# Altium schematic sheet AUX_CurrentSource.SchDoc
size B; SheetNumber: 5; SheetTotal: 15
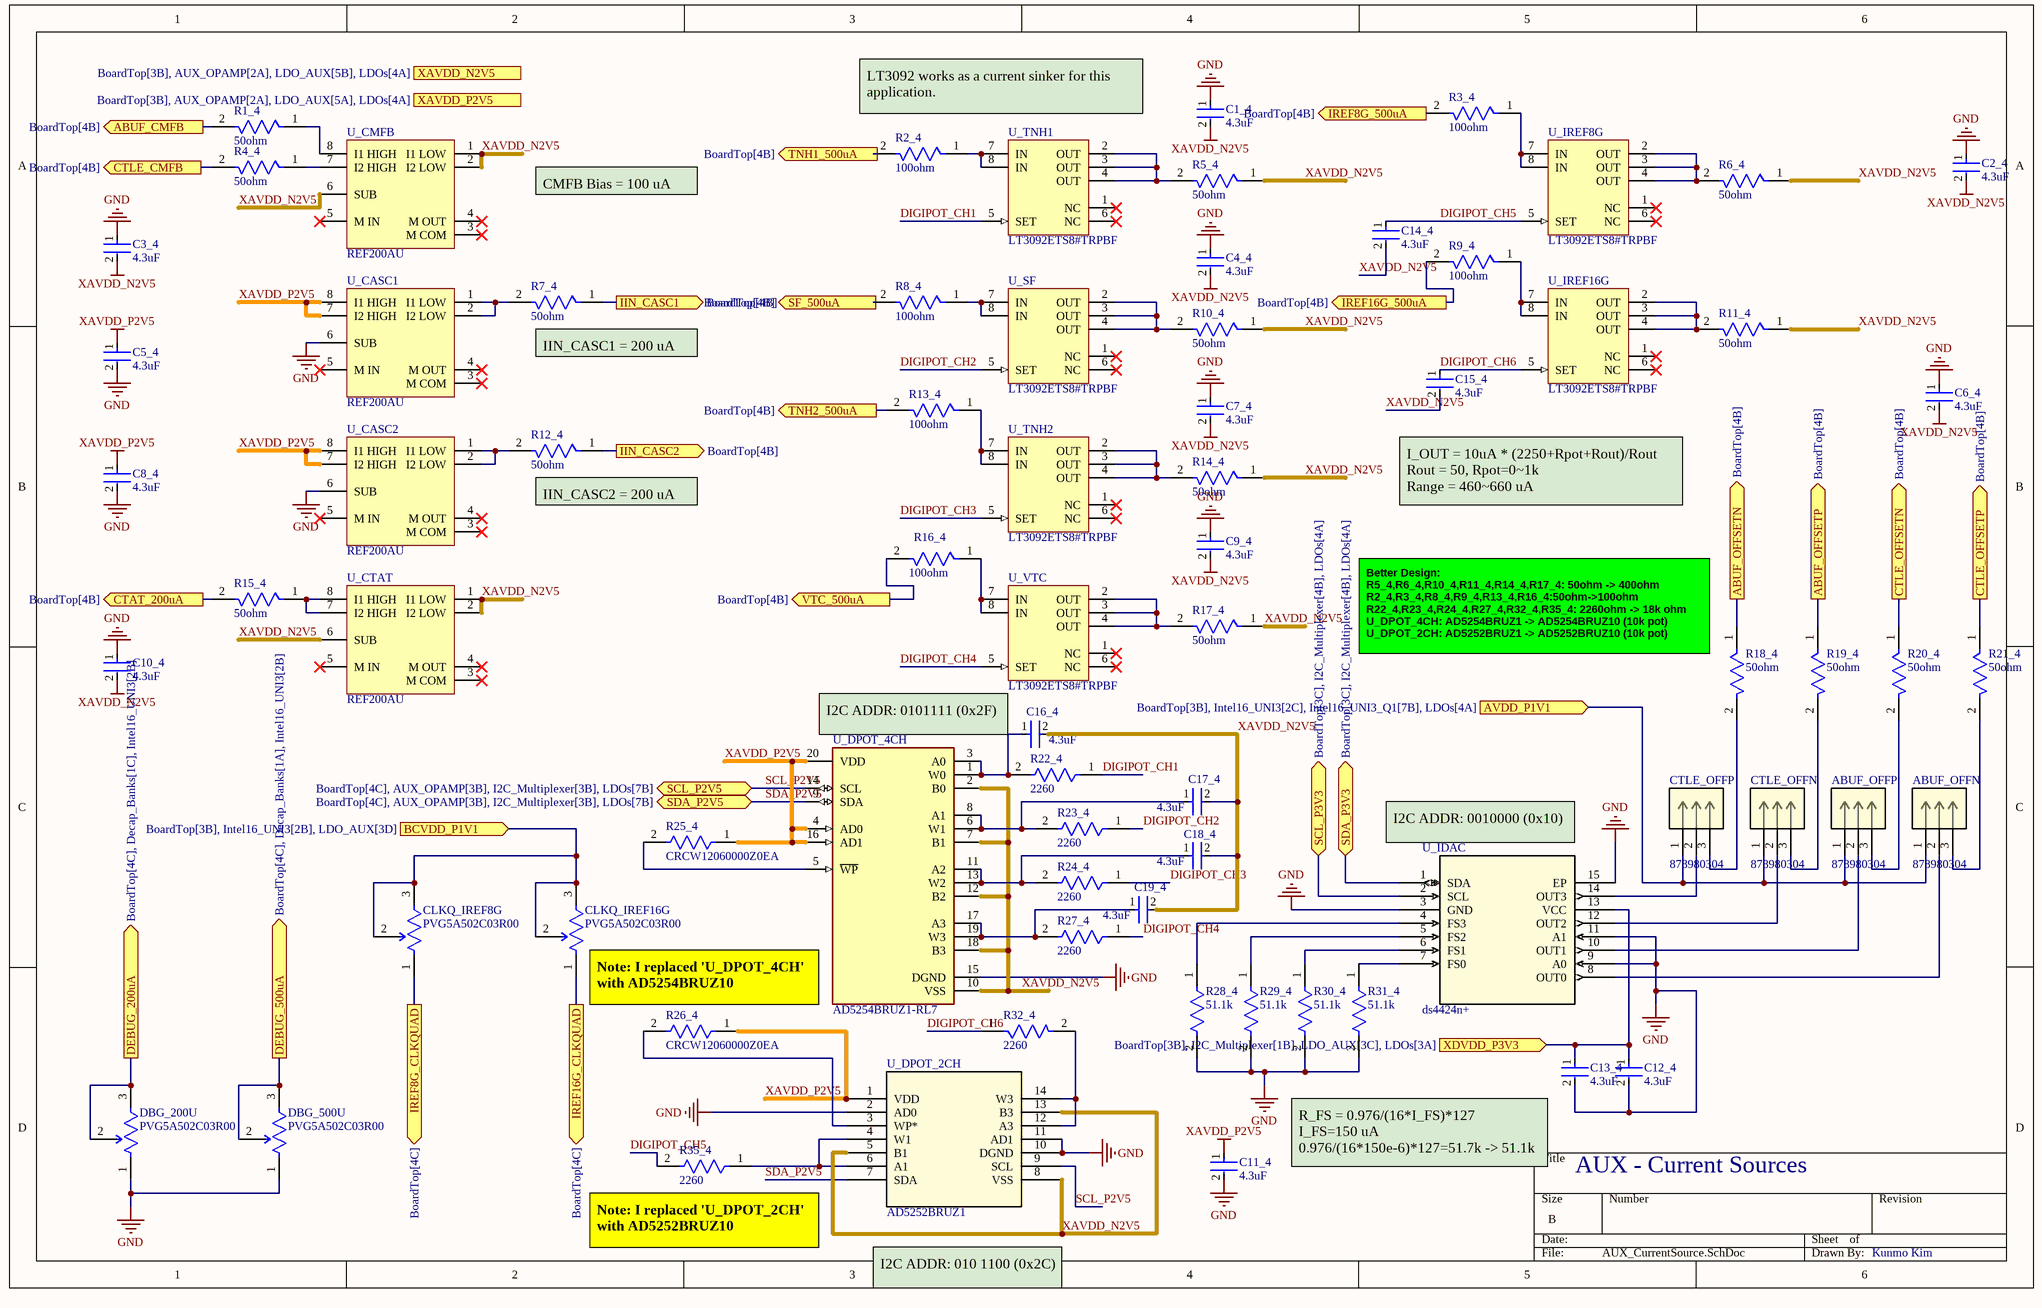
[diagram p0: AUX_CurrentSource.SchDoc]

## Parts
ABUF_OFFN  878980304  [CONN03_87898_M-5p84_MOL]
ABUF_OFFP  878980304  [CONN03_87898_M-5p84_MOL]
C1_4  4.3uF  [FP-LLL1U4-0_05-MFG]
C2_4  4.3uF  [FP-LLL1U4-0_05-MFG]
C3_4  4.3uF  [FP-LLL1U4-0_05-MFG]
C4_4  4.3uF  [FP-LLL1U4-0_05-MFG]
C5_4  4.3uF  [FP-LLL1U4-0_05-MFG]
C6_4  4.3uF  [FP-LLL1U4-0_05-MFG]
C7_4  4.3uF  [FP-LLL1U4-0_05-MFG]
C8_4  4.3uF  [FP-LLL1U4-0_05-MFG]
C9_4  4.3uF  [FP-LLL1U4-0_05-MFG]
C10_4  4.3uF  [FP-LLL1U4-0_05-MFG]
C11_4  4.3uF  [FP-LLL1U4-0_05-MFG]
C12_4  4.3uF  [FP-LLL1U4-0_05-MFG]
C13_4  4.3uF  [FP-LLL1U4-0_05-MFG]
C14_4  4.3uF  [FP-LLL1U4-0_05-MFG]
C15_4  4.3uF  [FP-LLL1U4-0_05-MFG]
C16_4  4.3uF  [FP-LLL1U4-0_05-MFG]
C17_4  4.3uF  [FP-LLL1U4-0_05-MFG]
C18_4  4.3uF  [FP-LLL1U4-0_05-MFG]
C19_4  4.3uF  [FP-LLL1U4-0_05-MFG]
CLKQ_IREF8G  PVG5A502C03R00  [FP-PVG5A-MFG]
CLKQ_IREF16G  PVG5A502C03R00  [FP-PVG5A-MFG]
CTLE_OFFN  878980304  [CONN03_87898_M-5p84_MOL]
CTLE_OFFP  878980304  [CONN03_87898_M-5p84_MOL]
DBG_200U  PVG5A502C03R00  [FP-PVG5A-MFG]
DBG_500U  PVG5A502C03R00  [FP-PVG5A-MFG]
R1_4  50ohm  [FP-RT0402-0_35-IPC_A]
R2_4  100ohm  [FP-RT0402-0_35-IPC_A]
R3_4  100ohm  [FP-RT0402-0_35-IPC_A]
R4_4  50ohm  [FP-RT0402-0_35-IPC_A]
R5_4  50ohm  [FP-RT0402-0_35-IPC_A]
R6_4  50ohm  [FP-RT0402-0_35-IPC_A]
R7_4  50ohm  [FP-RT0402-0_35-IPC_A]
R8_4  100ohm  [FP-RT0402-0_35-IPC_A]
R9_4  100ohm  [FP-RT0402-0_35-IPC_A]
R10_4  50ohm  [FP-RT0402-0_35-IPC_A]
R11_4  50ohm  [FP-RT0402-0_35-IPC_A]
R12_4  50ohm  [FP-RT0402-0_35-IPC_A]
R13_4  100ohm  [FP-RT0402-0_35-IPC_A]
R14_4  50ohm  [FP-RT0402-0_35-IPC_A]
R15_4  50ohm  [FP-RT0402-0_35-IPC_A]
R16_4  100ohm  [FP-RT0402-0_35-IPC_A]
R17_4  50ohm  [FP-RT0402-0_35-IPC_A]
R18_4  50ohm  [FP-RT0402-0_35-IPC_A]
R19_4  50ohm  [FP-RT0402-0_35-IPC_A]
R20_4  50ohm  [FP-RT0402-0_35-IPC_A]
R21_4  50ohm  [FP-RT0402-0_35-IPC_A]
R22_4  2260  [FP-RG1005-MFG]
R23_4  2260  [FP-RG1005-MFG]
R24_4  2260  [FP-RG1005-MFG]
R25_4  CRCW12060000Z0EA  [FP-CRCW1206-e3-IPC_C]
R26_4  CRCW12060000Z0EA  [FP-CRCW1206-e3-IPC_C]
R27_4  2260  [FP-RG1005-MFG]
R28_4  51.1k  [FP-RT0603-MFG]
R29_4  51.1k  [FP-RT0603-MFG]
R30_4  51.1k  [FP-RT0603-MFG]
R31_4  51.1k  [FP-RT0603-MFG]
R32_4  2260  [FP-RG1005-MFG]
R35_4  2260  [FP-RG1005-MFG]
U_CASC1  REF200AU  [D0008A_N]
U_CASC2  REF200AU  [D0008A_N]
U_CMFB  REF200AU  [D0008A_N]
U_CTAT  REF200AU  [D0008A_N]
U_DPOT_2CH  AD5252BRUZ1  [RU_14_ADI]
U_DPOT_4CH  AD5254BRUZ1-RL7  [FP-RU-20-IPC_B]
U_IDAC  ds4424n+  [21-0137_T1433+2_MXM]
U_IREF8G  LT3092ETS8#TRPBF  [TSOT-23_TS8]
U_IREF16G  LT3092ETS8#TRPBF  [TSOT-23_TS8]
U_SF  LT3092ETS8#TRPBF  [TSOT-23_TS8]
U_TNH1  LT3092ETS8#TRPBF  [TSOT-23_TS8]
U_TNH2  LT3092ETS8#TRPBF  [TSOT-23_TS8]
U_VTC  LT3092ETS8#TRPBF  [TSOT-23_TS8]

## Ports
ABUF_CMFB (out, see BoardTop[4B]), ABUF_OFFSETN (out, see BoardTop[4B]), ABUF_OFFSETP (out, see BoardTop[4B]), AVDD_P1V1 (in, see BoardTop[3B], Intel16_UNI3[2C], Intel16_UNI3_Q1[7B], LDOs[4A]), BCVDD_P1V1 (in, see BoardTop[3B], Intel16_UNI3[2B], LDO_AUX[3D]), CTAT_200uA (out, see BoardTop[4B]), CTLE_CMFB (out, see BoardTop[4B]), CTLE_OFFSETN (out, see BoardTop[4B]), CTLE_OFFSETP (out, see BoardTop[4B]), DEBUG_200uA (out, see BoardTop[4C], Decap_Banks[1C], Intel16_UNI3[2B]), DEBUG_500uA (out, see BoardTop[4C], Decap_Banks[1A], Intel16_UNI3[2B]), IIN_CASC1 (out, see BoardTop[4B]), IIN_CASC2 (out, see BoardTop[4B]), IREF8G_500uA (out, see BoardTop[4B]), IREF8G_CLKQUAD (out, see BoardTop[4C]), IREF16G_500uA (out, see BoardTop[4B]), IREF16G_CLKQUAD (out, see BoardTop[4C]), SCL_P2V5 (bidir, see BoardTop[4C], AUX_OPAMP[3B], I2C_Multiplexer[3B], LDOs[7B]), SCL_P3V3 (bidir, see BoardTop[3C], I2C_Multiplexer[4B], LDOs[4A]), SDA_P2V5 (bidir, see BoardTop[4C], AUX_OPAMP[3B], I2C_Multiplexer[3B], LDOs[7B]), SDA_P3V3 (bidir, see BoardTop[3C], I2C_Multiplexer[4B], LDOs[4A]), SF_500uA (out, see BoardTop[4B]), TNH1_500uA (out, see BoardTop[4B]), TNH2_500uA (out, see BoardTop[4B]), VTC_500uA (out, see BoardTop[4B]), XAVDD_N2V5 (in, see BoardTop[3B], AUX_OPAMP[2A], LDO_AUX[5B], LDOs[4A]), XAVDD_P2V5 (in, see BoardTop[3B], AUX_OPAMP[2A], LDO_AUX[5A], LDOs[4A]), XDVDD_P3V3 (in, see BoardTop[3B], I2C_Multiplexer[1B], LDO_AUX[3C], LDOs[3A])

## Nets
GND: C1_4.1 C2_4.1 C3_4.1 C4_4.1 C5_4.2 C6_4.1 C7_4.1 C8_4.2 C9_4.1 C10_4.1 C11_4.2 C12_4.2 C13_4.2 DBG_200U.1(CCW) DBG_500U.1(CCW) R28_4.2 R29_4.2 R30_4.2 R31_4.2 U_CASC1.6(SUB) U_CASC2.6(SUB) U_DPOT_2CH.2(AD0) U_DPOT_2CH.10(DGND) U_DPOT_2CH.11(AD1) U_DPOT_4CH.15(DGND) U_IDAC.3(GND) U_IDAC.9(A0) U_IDAC.11(A1) U_IDAC.15(EP)
XAVDD_N2V5: C1_4.2 C2_4.2 C3_4.2 C4_4.2 C6_4.2 C7_4.2 C9_4.2 C10_4.2 C14_4.2 C15_4.2 C16_4.2 C17_4.2 C18_4.2 C19_4.2 R5_4.1 R6_4.1 R10_4.1 R11_4.1 R14_4.1 R17_4.1 U_CMFB.1(I1_LOW) U_CMFB.2(I2_LOW) U_CMFB.6(SUB) U_CTAT.1(I1_LOW) U_CTAT.2(I2_LOW) U_CTAT.6(SUB) U_DPOT_2CH.5(B1) U_DPOT_2CH.8(VSS) U_DPOT_2CH.13(B3) U_DPOT_4CH.2(B0) U_DPOT_4CH.7(B1) U_DPOT_4CH.10(VSS) U_DPOT_4CH.12(B2) U_DPOT_4CH.18(B3)
XAVDD_P2V5: C5_4.1 C8_4.1 C11_4.1 R25_4.1 R26_4.1 U_CASC1.7(I2_HIGH) U_CASC1.8(I1_HIGH) U_CASC2.7(I2_HIGH) U_CASC2.8(I1_HIGH) U_DPOT_2CH.1(VDD) U_DPOT_4CH.4(AD0) U_DPOT_4CH.16(AD1) U_DPOT_4CH.20(VDD)
ABUF_CMFB: R1_4.2 ; port ABUF_CMFB
ABUF_OFFSETN: R18_4.1 ; port ABUF_OFFSETN
ABUF_OFFSETP: R19_4.1 ; port ABUF_OFFSETP
AVDD_P1V1: ABUF_OFFN.1 ABUF_OFFP.1 CTLE_OFFN.1 CTLE_OFFP.1 ; port AVDD_P1V1
BCVDD_P1V1: CLKQ_IREF8G.2(WIPER) CLKQ_IREF8G.3(CW) CLKQ_IREF16G.2(WIPER) CLKQ_IREF16G.3(CW) ; port BCVDD_P1V1
CTAT_200uA: R15_4.2 ; port CTAT_200uA
CTLE_CMFB: R4_4.2 ; port CTLE_CMFB
CTLE_OFFSETN: R20_4.1 ; port CTLE_OFFSETN
CTLE_OFFSETP: R21_4.1 ; port CTLE_OFFSETP
DEBUG_200uA: DBG_200U.2(WIPER) DBG_200U.3(CW) ; port DEBUG_200uA
DEBUG_500uA: DBG_500U.2(WIPER) DBG_500U.3(CW) ; port DEBUG_500uA
DIGIPOT_CH1: R22_4.1 U_TNH1.5(SET)
DIGIPOT_CH2: R23_4.1 U_SF.5(SET)
DIGIPOT_CH3: R24_4.1 U_TNH2.5(SET)
DIGIPOT_CH4: R27_4.1 U_VTC.5(SET)
DIGIPOT_CH5: C14_4.1 R35_4.2 U_IREF8G.5(SET)
DIGIPOT_CH6: C15_4.1 R32_4.1 U_IREF16G.5(SET)
IIN_CASC1: R7_4.1 ; port IIN_CASC1
IIN_CASC2: R12_4.1 ; port IIN_CASC2
IREF8G_500uA: R3_4.2 ; port IREF8G_500uA
IREF8G_CLKQUAD: CLKQ_IREF8G.1(CCW) ; port IREF8G_CLKQUAD
IREF16G_500uA: R9_4.2 ; port IREF16G_500uA
IREF16G_CLKQUAD: CLKQ_IREF16G.1(CCW) ; port IREF16G_CLKQUAD
SCL_P2V5: U_DPOT_2CH.9(SCL) U_DPOT_4CH.14(SCL) ; port SCL_P2V5
SCL_P3V3: U_IDAC.2(SCL) ; port SCL_P3V3
SDA_P2V5: U_DPOT_2CH.7(SDA) U_DPOT_4CH.9(SDA) ; port SDA_P2V5
SDA_P3V3: U_IDAC.1(SDA) ; port SDA_P3V3
SF_500uA: R8_4.2 ; port SF_500uA
TNH1_500uA: R2_4.2 ; port TNH1_500uA
TNH2_500uA: R13_4.2 ; port TNH2_500uA
VTC_500uA: R16_4.2 ; port VTC_500uA
XDVDD_P3V3: C12_4.1 C13_4.1 U_IDAC.13(VCC) ; port XDVDD_P3V3
NetABUF_OFFN_2: ABUF_OFFN.2 U_IDAC.8(OUT0)
NetABUF_OFFN_3: ABUF_OFFN.3 R21_4.2
NetABUF_OFFP_2: ABUF_OFFP.2 U_IDAC.10(OUT1)
NetABUF_OFFP_3: ABUF_OFFP.3 R20_4.2
NetC16_4_1: C16_4.1 R22_4.2 U_DPOT_4CH.1(W0) U_DPOT_4CH.3(A0)
NetC17_4_1: C17_4.1 R23_4.2 U_DPOT_4CH.6(W1) U_DPOT_4CH.8(A1)
NetC18_4_1: C18_4.1 R24_4.2 U_DPOT_4CH.11(A2) U_DPOT_4CH.13(W2)
NetC19_4_1: C19_4.1 R27_4.2 U_DPOT_4CH.17(A3) U_DPOT_4CH.19(W3)
NetCTLE_OFFN_2: CTLE_OFFN.2 U_IDAC.12(OUT2)
NetCTLE_OFFN_3: CTLE_OFFN.3 R19_4.2
NetCTLE_OFFP_2: CTLE_OFFP.2 U_IDAC.14(OUT3)
NetCTLE_OFFP_3: CTLE_OFFP.3 R18_4.2
NetR1_4_1: R1_4.1 U_CMFB.8(I1_HIGH)
NetR2_4_1: R2_4.1 U_TNH1.7(IN) U_TNH1.8(IN)
NetR3_4_1: R3_4.1 U_IREF8G.7(IN) U_IREF8G.8(IN)
NetR4_4_1: R4_4.1 U_CMFB.7(I2_HIGH)
NetR5_4_2: R5_4.2 U_TNH1.2(OUT) U_TNH1.3(OUT) U_TNH1.4(OUT)
NetR6_4_2: R6_4.2 U_IREF8G.2(OUT) U_IREF8G.3(OUT) U_IREF8G.4(OUT)
NetR7_4_2: R7_4.2 U_CASC1.1(I1_LOW) U_CASC1.2(I2_LOW)
NetR8_4_1: R8_4.1 U_SF.7(IN) U_SF.8(IN)
NetR9_4_1: R9_4.1 U_IREF16G.7(IN) U_IREF16G.8(IN)
NetR10_4_2: R10_4.2 U_SF.2(OUT) U_SF.3(OUT) U_SF.4(OUT)
NetR11_4_2: R11_4.2 U_IREF16G.2(OUT) U_IREF16G.3(OUT) U_IREF16G.4(OUT)
NetR12_4_2: R12_4.2 U_CASC2.1(I1_LOW) U_CASC2.2(I2_LOW)
NetR13_4_1: R13_4.1 U_TNH2.7(IN) U_TNH2.8(IN)
NetR14_4_2: R14_4.2 U_TNH2.2(OUT) U_TNH2.3(OUT) U_TNH2.4(OUT)
NetR15_4_1: R15_4.1 U_CTAT.7(I2_HIGH) U_CTAT.8(I1_HIGH)
NetR16_4_1: R16_4.1 U_VTC.7(IN) U_VTC.8(IN)
NetR17_4_2: R17_4.2 U_VTC.2(OUT) U_VTC.3(OUT) U_VTC.4(OUT)
NetR25_4_2: R25_4.2 U_DPOT_4CH.5(~{WP})
NetR26_4_2: R26_4.2 U_DPOT_2CH.3(WP*)
NetR28_4_1: R28_4.1 U_IDAC.4(FS3)
NetR29_4_1: R29_4.1 U_IDAC.5(FS2)
NetR30_4_1: R30_4.1 U_IDAC.6(FS1)
NetR31_4_1: R31_4.1 U_IDAC.7(FS0)
NetR32_4_2: R32_4.2 U_DPOT_2CH.12(A3) U_DPOT_2CH.14(W3)
NetR35_4_1: R35_4.1 U_DPOT_2CH.4(W1) U_DPOT_2CH.6(A1)

Not connected (* = marked no-connect by the designer): U_CASC1 3(M_COM)* 4(M_OUT)* 5(M_IN)*; U_CASC2 3(M_COM)* 4(M_OUT)* 5(M_IN)*; U_CMFB 3(M_COM)* 4(M_OUT)* 5(M_IN)*; U_CTAT 3(M_COM)* 4(M_OUT)* 5(M_IN)*; U_IREF8G 1(NC)* 6(NC)*; U_IREF16G 1(NC)* 6(NC)*; U_SF 1(NC)* 6(NC)*; U_TNH1 1(NC)* 6(NC)*; U_TNH2 1(NC)* 6(NC)*; U_VTC 1(NC)* 6(NC)*

## Notes on the sheet
- LT3092 works as a current sinker for this application.
- CMFB Bias = 100 uA
- (near R7_4) IIN_CASC1 = 200 uA
- (near R12_4) IIN_CASC2 = 200 uA
- I_OUT = 10uA * (2250+Rpot+Rout)/Rout
  Rout = 50, Rpot=0~1k
  Range = 460~660 uA
  i.e.: for 500 uA, Rpot =
- (near R18_4) Better Design:
  R5_4,R6_4,R10_4,R11_4,R14_4,R17_4: 50ohm -> 400ohm
  R2_4,R3_4,R8_4,R9_4,R13_4,R16_4:50ohm->100ohm
  R22_4,R23_4,R24_4,R27_4,R32_4,R35_4: 2260ohm -> 18k ohm
  U_DPOT_4CH: AD5254BRUZ1 -> AD5254BRUZ10 (10k pot)
  U_DPOT_2CH: AD5252BRUZ1 -> AD5252BRUZ10 (10k pot)
- I2C ADDR: 0101111 (0x2F)
- (near U_IDAC) I2C ADDR: 0010000 (0x10)
- Note: I replaced 'U_DPOT_4CH' with AD5254BRUZ10
- (near C13_4) R_FS = 0.976/(16*I_FS)*127
  I_FS=150 uA
  0.976/(16*150e-6)*127=51.7k -> 51.1k
- AUX - Current Sources
- (near R35_4) Note: I replaced 'U_DPOT_2CH' with AD5252BRUZ10
- I2C ADDR: 010 1100 (0x2C)
- Kunmo Kim

## Library data of the parts
ABUF_OFFN ABUF_OFFP CTLE_OFFN CTLE_OFFP = 878980304: No Description Available; Mfr_Name: Molex Connector Corporation; RefDes: RefDes; Type: Type
C1_4 C2_4 C3_4 C4_4 C5_4 C6_4 C7_4 C8_4 C9_4 C10_4 C11_4 C12_4 C13_4 C14_4 C15_4 C16_4 C17_4 C18_4 C19_4 = CMP-06035-061933-1: Cap Ceramic Monolithic 4.3uF 20% 4V X5R 15% 02404 (0610M); Capacitance: 4.3uF; Tolerance: 20%; Min Operating Temperature: -55°C; Case/Package: 0204; Voltage Rating: 4V; Mount: Surface Mount; Max Operating Temperature: 85°C; Packaging: Tape and Reel; RoHS Compliant: Yes
CLKQ_IREF8G CLKQ_IREF16G DBG_200U DBG_500U = CMP-00059-71526922-1: PVG5A502C03R00 Resistor Trimmer, Cermet, 5 kOhm, ± 10%, 250 mW, 12 Turn, Multi Turn, Surface Mount; Temperature Coefficient: 150ppm/°C; Power Rating: 250mW; Resistance: 5kΩ; Number of Turns: 11; Schedule B: 8533400080, 8533400080|8533400080|8533400080|8533400080|8533400080; RoHS: Compliant; Height: 5.1054mm; Max Operating Temperature: 125°C; Min Operating Temperature: -55°C; Mount: Surface Mount; Max Power Dissipation: 250mW; NexarPartId: 71526922; Tolerance: 10%; Composition: Cermet
R1_4 R2_4 R3_4 R4_4 R5_4 R6_4 R7_4 R8_4 R9_4 R10_4 R11_4 R12_4 R13_4 R14_4 R15_4 R16_4 R17_4 R18_4 R19_4 R20_4 R21_4 = CMP-00621-71392720-1: RT0402BRE0750RL Fixed Resistor, Thin Film, 0.0625W, 50ohm, 50V, 0.1% +/-Tol, 50ppm/Cel, Surface Mount, 0402; Max Power Dissipation: 63mW; Temperature Coefficient: 50ppm/°C; Resistance: 50Ω; Features: Moisture Resistant; Max Operating Temperature: 155°C; Tolerance: 0.1%; Min Operating Temperature: -55°C; Case/Package: 0402; Packaging: Tape & Reel; RoHS: Compliant; Width: 508µm; Height: 355.6µm; NexarPartId: 71392720; Composition: Thin Film; Length: 990.6µm; Number of Terminations: 2; Supplier 1: Digikey; Supplier Part Number 1: 13-RT0402BRE0750RLCT-ND
R22_4 R23_4 R24_4 R27_4 R32_4 R35_4 = CMP-28537-006422-1: Automotive Metal Thin Film Chip Resistor, 0402, 2.26kΩ, 0.1%, 25ppm/°C, 0.0625W, 75V; Voltage Rating: 25V; Power Rating: 30mW; Resistance: 2.26kR; Max Power Dissipation: 63mW; Lead Free: Lead Free; Packaging: Tape and Reel; Case/Package: 0402; Termination: SMD/SMT; Series: RG; Length: 0.039inch; Temperature Coefficient: 25ppm/°C; Max Operating Temperature: 155°C; Resistor Type: Thin Film; Features: Automotive AEC-Q200; Height: 0.016inch; Number of Terminations: 2; Case Code (Metric): 1005; Case Code (Imperial): 0402; Voltage Rating (DC): 25V; RoHS Compliant: Yes; Width: 0.02inch; Min Operating Temperature: -55°C; Tolerance: 0.1%; Package Quantity: 5000
R25_4 R26_4 = CMP-2003-04857-2: RES Thick Film, 0Ω, 0.25W, 1206; Resistance: 0mR; Power Rating: 250mW; Temperature Coefficient: 100ppm/°C; Tolerance: 1%; Voltage Rating (DC): 200V; Width: 1.6mm; Termination: SMD/SMT; Contact Plating: Tin; Min Operating Temperature: -55°C; Military Standard: Not; Mount: Surface Mount; Case Code (Metric): 3216; Case Code (Imperial): 1206; Packaging: Tape and Reel; Depth: 1.6mm; Case/Package: 1206; Radiation Hardening: No; Height: 0.55mm; Package Quantity: 5000; Weight: 0.000353oz; Max Operating Temperature: 155°C; Length: 3.2mm; Composition: Thick Film; Lead Free: Lead Free; Voltage Rating: 200V
R28_4 R29_4 R30_4 R31_4 = CMP-2000-04475-2: RES SMD 51.1K OHM 0.1% 1/10W; Manufacturer: Yageo; Manufacturer Part Number: RT0603BRD0751K1L; Tolerance: 0.001; Temperature Coefficient: 25 ppm/°C; Voltage Rating: 75V; Power Rating: 0.1W; Resistance: 51.1KΩ; Value: 51.1KΩ; Height: 0.55mm; ComponentLink2Description: Datasheet; Ipc Land Pattern Name: RESC16080X45; Digikey Description: RES SMD 51.1K OHM 0.1% 1/10W; RoHS: TRUE; Temperature Range Low: -55°C; Composition: Thin Film; Mouser Description: Thin Film Resistors - SMD 1/10W 51.1K ohm .1% 25ppm; Device Class L2: Resistors; Octopart: https://octopart.com/rt0603brd0751k1l-yageo-1281879; Device Class L3: Chip SMD Resistors; Device Class L1: Passive Components; ComponentLink2URL: http://www.yageo.com/documents/recent/PYu-RT_1-to-0.01_RoHS_L_9.pdf; Automotive: No; Series: RT; Category: Res; Lead Free: Yes; Footprint Url: http://www.yageo.com/exep/pages/download/literatures/PYu-R_Mount_10.pdf; Temperature Range High: +155°C; Temperature: -55°C to +155°C; Package: RT0603
U_CASC1 U_CASC2 U_CMFB U_CTAT = CMP-0368-00004-2: Dual Current Source / Current Sink, 2.5 to 40 V, 0.1 mA, -25 to 85 degC, 8-pin SOIC (D), Green (RoHS & no Sb/Br); Manufacturer: Texas Instruments; Iout/Iz(Max)(mA): 0.1; VI(Min)(V): 2.5; VI(Max)(V): 40; SubFamily: Current Reference; Code_JEDEC: MS-012; ComponentLink3URL: http://www.ti.com/litv/pdf/msoi002j; ComponentLink3Description: Package Specification; ComponentLink2Description: Datasheet; PartNumber: REF200AU; DatasheetVersion: SBVS020; ComponentLink2URL: http://www.ti.com/general/docs/lit/getliterature.tsp?genericPartNumber=REF200&fileType=pdf; ComponentLink1Description: Manufacturer URL; PackageVersion: 4040047-3/M; PackageReference: D0008A; ComponentLink1URL: http://www.ti.com/; PackageDescription: 8-Pin Plastic Small Outline, Body 4.9 x 3.9 mm, Pitch 1.27 mm; Eco-Plan: Green (RoHS & no Sb/Br); Mounting Technology: Surface Mount
U_DPOT_2CH = AD5252BRUZ1: No Description Available; Mfr_Name: Analog Devices Inc; RefDes: RefDes; Type: Type; Supplier 1: Mouser; Supplier Part Number 1: 584-AD5252BRUZ1
U_DPOT_4CH = CMP-09083-000143-1: IC DGTL POT 1KOHM 256TAP 20TSSOP; Operating Supply Current: 3uA; Memory Type: Non-Volatile; Min Supply Voltage: 2.7V; Number of Taps: 256; Max Dual Supply Voltage: 2.75V; Dual Supply Voltage: 2.5V; Quiescent Current: 5uA; Tolerance: 30%; Temperature Coefficient: 650ppm/°C; Max Supply Voltage: 5.5V; Number of Elements: 4; Interface: I2C; Frequency: 400kHz; Resistance: 1kR; Min Dual Supply Voltage: 2.25V; -3db Bandwidth: 4MHz; Min Operating Temperature: -40°C; Max Operating Temperature: 85°C; Lead Free: Contains Lead; Case/Package: TSSOP; Mount: Surface Mount; Number of Pins: 20; Package Quantity: 1000; Nominal Supply Current: 3uA; Series: -; Taper: Linear; Number of Positions: 256; Contact Plating: Tin; RoHS Compliant: Yes; Max Supply Current: 5uA; Number of Circuits: 4; Packaging: Tape and Reel
U_IDAC = ds4424n+: No Description Available; Mfr_Name: Analog Devices Inc; RefDes: RefDes; Type: Type; Supplier 1: Mouser; Supplier Part Number 1: 700-DS4424N
U_IREF8G U_IREF16G U_SF U_TNH1 U_TNH2 U_VTC = CMP-0472-00072-1: 200 mA Two-Terminal Programmable Current Source, 0.3 mA Isupply, 8-pin SOT23 (TS8-8), -40 to 125 degC, Pb-Free, Tape and Reel; Manufacturer: Linear Technology; Output Current Range: 0.5 mA to 200 mA; Vin Max(V): 40; Vin Min(V): 1.2; Isupply(mA): 0.3; Initial Accuracy(%): 1; Extended Temp: E, I, MP; ComponentLink2URL: http://cds.linear.com/docs/en/datasheet/3092fb.pdf; RoHS: TRUE; ComponentLink1Description: Manufacturer URL; Mounting Technology: Surface Mount; ComponentLink2Description: Datasheet; DatasheetVersion: Rev. B; ComponentLink1URL: http://www.linear.com/; Packing: Tape and Reel; PackageDescription: 8-Pin Plastic TSOT-23, Body 2.9 x 1.63 mm, Pitch 0.65 mm; PackageVersion: Rev. A, 08/2010; Code_JEDEC: MO-193; PartNumber: LT3092ETS8#TRPBF; ComponentLink3Description: Package Specification; ComponentLink3URL: http://cds.linear.com/docs/en/packaging/SOT_8_05-08-1637.pdf; PackageReference: TS8-8; Supplier 1: Mouser; Supplier Part Number 1: 584-LT3092ETS8#TRPBF